# EAGLE design ESP-32-UNICLOCK-VFD (EAGLE 6.3)
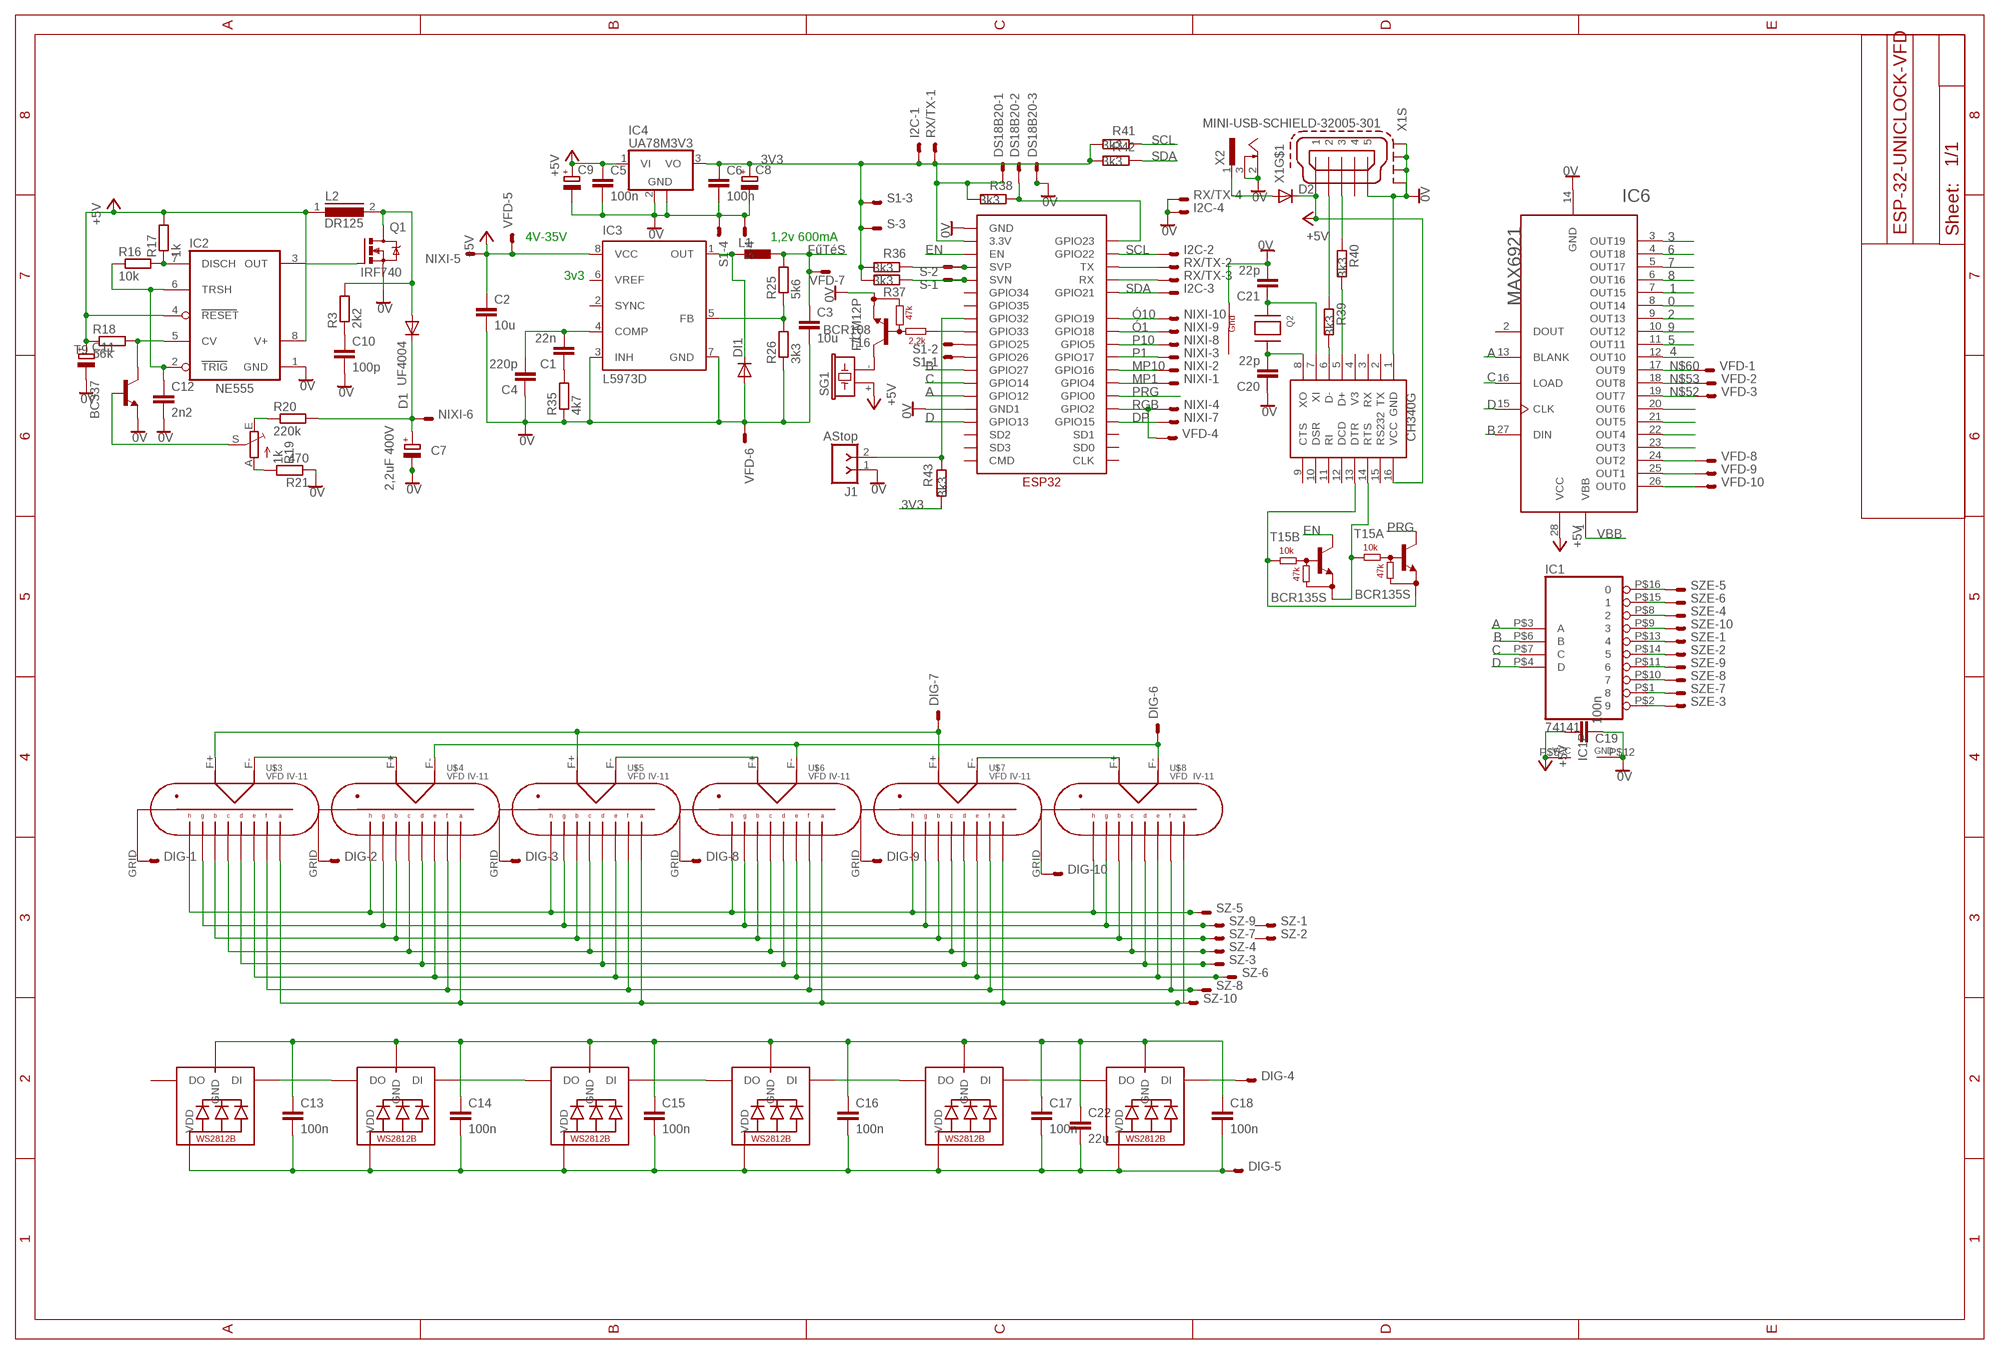
[diagram p0: schematic, sheet 1]

## Parts
C1  22n  C0603  [0603]
C2  10u  C1206  [1206]
C3  10u  C1206  [1206]
C4  220p  C0603  [0603]
C5  100n  C0603  [0603]
C6  100n  C0603  [0603]
C7  2,2uF 400V  CPOL-EUE2.5-7  [E2,5-7]
C8  CPOL-EUE2.5-5  [E2,5-5]
C9  CPOL-EUE2.5-5  [E2,5-5]
C10  100p  C-EU050-024X044  [C050-024X044]
C11  CPOL-EUE2.5-7  [E2,5-7]
C12  2n2  C-EUC0603  [C0603]
C13  100n  C-EUC0603  [C0603]
C14  100n  C-EUC0603  [C0603]
C15  100n  C-EUC0603  [C0603]
C16  100n  C-EUC0603  [C0603]
C17  100n  C-EUC0603  [C0603]
C18  100n  C-EUC0603  [C0603]
C19  100n  C0603  [0603]
C20  22p  C0603  [0603]
C21  22p  C0603  [0603]
C22  22u  C-EUC1206K  [C1206K]
D1  UF4004  BA221  [DO35-10]
D2  DIODE-SOD123  [SOD123]
DI1  DDI214  [DI-214]
DIG  DIG  PAD10  [PAD10]
DS18B20  PAD3  [PAD3]
I2C  PAD4  [PAD4]
IC1  74141  [DIL16SMD]
IC2  NE555  ICM7555  [DIL08]
IC3  L5973D  [HSOP8]
IC4  UA78M3V3  UA78M05DCY  [SOT223]
IC6  MAX6921  MAX6921SOIC28W  [SO-28W]
J1  AStop  F-1X02-SIP-100-32  [SIP-100-02-32]
L1  LDR73A  [DR73A]
L2  DR125  [DR125]
LED1  WS2812B_5050N  [WS2812B-NARROW]
LED2  WS2812B_5050N  [WS2812B-NARROW]
LED3  WS2812B_5050N  [WS2812B-NARROW]
LED4  WS2812B_5050N  [WS2812B-NARROW]
LED5  WS2812B_5050N  [WS2812B-NARROW]
LED6  WS2812B_5050N  [WS2812B-NARROW]
NIXI  PAD10  [PAD10]
Q1  IRF740  [TO220BV]
Q2  XTAL-4-3225  [NX3225]
R3  2k2  R-EU_0204/7  [0204/7]
R16  10k  R-EU_R0603  [R0603]
R17  1k  R-EU_R0603  [R0603]
R18  56k  R-EU_R0603  [R0603]
R19  1k  TRIM_EU-CA6H  [CA6H]
R20  220k  R-EU_0204/7  [0204/7]
R21  470  R-EU_0204/7  [0204/7]
R25  5k6  R0603  [0603]
R26  3k3  R0603  [0603]
R35  4k7  R0603  [0603]
R36  3k3  R0603  [0603]
R37  3k3  R0603  [0603]
R38  3k3  R0603  [0603]
R39  3k3  R0603  [0603]
R40  3k3  R0603  [0603]
R41  3k3  R0603  [0603]
R42  3k3  R0603  [0603]
R43  3k3  R0603  [0603]
RX/TX  PAD4  [PAD4]
S  PAD4  [PAD4]
S1  PAD4  [PAD4]
SG1  F/CM12P  [F/CM12P]
SZ  PAD10  [PAD10]
SZE  PAD10  [PAD10]
T9  BC337  BC237-NPN-TO92-CBE  [TO92-CBE]
T15  BCR135S  [SOT363_INFINEON]
T16  BCR108  [SOT23-BEC]
U$1  CH340G  [SOIC16]
U$2  ESP32-2X18  [ESP322X18]
U$3  VFD IV-11  VFD-IV-11-ZOLI  [VFD-IV_11-ZOLI]
U$4  VFD IV-11  VFD-IV-11-ZOLI  [VFD-IV_11-ZOLI]
U$5  VFD IV-11  VFD-IV-11-ZOLI  [VFD-IV_11-ZOLI]
U$6  VFD IV-11  VFD-IV-11-ZOLI  [VFD-IV_11-ZOLI]
U$7  VFD IV-11  VFD-IV-11-ZOLI  [VFD-IV_11-ZOLI]
U$8  VFD IV-11  VFD-IV-11-ZOLI  [VFD-IV_11-ZOLI]
VFD  PAD10  [PAD10]
X1  MINI-USB-SCHIELD-32005-301  [32005-301]
X2  733989-5  [733989-5]

## Nets
0: IC1.P$16 IC6.8(OUT14) SZE.P$5
0V: C2.2 C3.2 C4.1 C5.2 C6.2 C7.- C8.- C9.- C10.2 C11.- C12.2 C19.2 C20.1 C21.2 DI1.A DS18B20.P$3 I2C.P$4 IC1.P$12(GND) IC2.1(GND) IC3.3(INH) IC3.7(GND) IC4.2(GND) IC4.4(GND) IC6.14(GND) J1.1 Q1.S Q2.4(G1) R21.1 R26.1 R35.1 RX/TX.P$4 S1.P$4 S.P$4 T9.E T16.E U$1.1(GND) U$2.P$19(GND) U$2.P$26(GND1) VFD.P$6 X1.5 X1.M1(S:S1) X1.M2(S:S2) X1.M3(S:S3) X1.M4(S:S4) X2.2 X2.3
1: IC1.P$15 IC6.7(OUT15) SZE.P$6
2: IC1.P$8 IC6.9(OUT13) SZE.P$4
3: IC1.P$9 IC6.3(OUT19) SZE.P$10
3V3: C6.1 C8.+ DS18B20.P$1 I2C.P$1 IC4.3(VO) R36.2 R37.2 R38.2 R41.2 R42.2 R43.2 RX/TX.P$1 S1.P$3 S.P$3 U$2.P$20(3.3V)
4: IC1.P$13 IC6.12(OUT10) SZE.P$1
5: IC1.P$14 IC6.11(OUT11) SZE.P$2
6: IC1.P$11 IC6.4(OUT18) SZE.P$9
7: IC1.P$10 IC6.5(OUT17) SZE.P$8
8: IC1.P$1 IC6.6(OUT16) SZE.P$7
9: IC1.P$2 IC6.10(OUT12) SZE.P$3
+5V: C2.1 C5.1 C9.+ C11.+ C19.1 D2.C IC1.P$5(VCC) IC2.4(RESET) IC2.8(V+) IC3.8(VCC) IC4.1(VI) IC6.28(VCC) L2.1 NIXI.P$5 R17.2 R18.1 SG1.+ U$1.16(VCC) VFD.P$5 X1.1
A: IC1.P$3(A) IC6.13(BLANK) U$2.P$12(GPIO12)
B: IC1.P$6(B) IC6.27(DIN) U$2.P$10(GPIO27)
C: IC1.P$7(C) IC6.16(LOAD) U$2.P$9(GPIO14)
D: IC1.P$4(D) IC6.15(CLK) U$2.P$11(GPIO13)
DP: NIXI.P$7 U$2.P$35(GPIO15)
EN: T15.3(B:C) U$2.P$21(EN)
FűTéS: C3.1 L1.2 R25.2 VFD.P$7
GND: C13.1 C14.1 C15.1 C16.1 C17.1 C18.1 C22.1 DIG.P$6 LED1.3-GND(GND) LED2.3-GND(GND) LED3.3-GND(GND) LED4.3-GND(GND) LED5.3-GND(GND) LED6.3-GND(GND) U$4.F- U$6.F- U$8.F-
MP1: NIXI.P$1 U$2.P$34(GPIO4)
MP10: NIXI.P$2 U$2.P$31(GPIO16)
N$1: T15.1(A:E) T15.5(B:B) U$1.13(DTR)
N$2: S1.P$1 U$2.P$7(GPIO26)
N$3: IC6.26(OUT0) VFD.P$10
N$4: IC6.25(OUT1) VFD.P$9
N$5: C1.1 R35.2
N$6: C1.2 C4.2 IC3.4(COMP)
N$7: IC3.5(FB) R25.1 R26.2
N$8: IC6.24(OUT2) VFD.P$8
N$9: DI1.K(C) IC3.1(OUT) L1.1
N$10: DIG.P$1 U$3.GRID
N$11: DIG.P$2 U$4.GRID
N$12: DIG.P$3 U$5.GRID
N$13: DIG.P$10 U$8.GRID
N$14: DIG.P$9 U$7.GRID
N$15: DIG.P$8 U$6.GRID
N$16: U$7.F- U$8.F+
N$17: U$5.F- U$6.F+
N$18: R19.E R20.1
N$19: U$3.F- U$4.F+
N$20: R19.A R21.2
N$21: DIG.P$7 U$3.F+ U$5.F+ U$7.F+
N$22: IC2.3(OUT) Q1.G
N$23: IC2.7(DISCH) R16.2 R17.1
N$24: C12.1 IC2.2(TRIG) IC2.6(TRSH) R16.1
N$26: IC2.5(CV) R18.2 T9.C
N$27: C10.1 R3.1
N$28: R37.1 S.P$1 U$2.P$1(SVN)
N$43: IC6.23(OUT3)
N$44: D1.A L2.2 Q1.D R3.2
N$46: DS18B20.P$2 R38.1 U$2.P$23(GPIO23)
N$49: IC6.22(OUT4)
N$50: IC6.21(OUT5)
N$51: IC6.20(OUT6)
N$52: IC6.19(OUT7) VFD.P$3
N$53: IC6.18(OUT8) VFD.P$2
N$54: LED1.2-DOUT(DO) LED2.4-DIN(DI)
N$55: LED2.2-DOUT(DO) LED3.4-DIN(DI)
N$57: SZ.P$5 U$3.H U$4.H U$5.H U$6.H U$7.H U$8.H
N$58: SZ.P$9 U$3.G U$4.G U$5.G U$6.G U$7.G U$8.G
N$59: SZ.P$7 U$3.B U$4.B U$5.B U$6.B U$7.B U$8.B
N$60: IC6.17(OUT9) VFD.P$1
N$61: SZ.P$4 U$3.C U$4.C U$5.C U$6.C U$7.C U$8.C
N$62: SZ.P$3 U$3.D U$4.D U$5.D U$6.D U$7.D U$8.D
N$63: SZ.P$6 U$3.E U$4.E U$5.E U$6.E U$7.E U$8.E
N$64: SZ.P$8 U$3.F U$4.F U$5.F U$6.F U$7.F U$8.F
N$65: LED3.2-DOUT(DO) LED4.4-DIN(DI)
N$66: LED4.2-DOUT(DO) LED5.4-DIN(DI)
N$70: D2.A X2.1
N$71: DIG.P$4 LED1.4-DIN(DI)
N$72: R36.1 S.P$2 U$2.P$2(SVP)
N$73: S1.P$2 U$2.P$8(GPIO25)
N$74: R39.1 X1.2
N$75: R40.2 U$1.5(D+)
N$76: R39.2 U$1.6(D-)
N$77: R40.1 X1.3
N$78: LED5.2-DOUT(DO) LED6.4-DIN(DI)
N$79: T15.2(A:B) T15.4(B:E) U$1.14(RTS)
N$80: C20.2 Q2.3(X2) U$1.8(XO)
N$81: C13.2 C14.2 C15.2 C16.2 C17.2 C18.2 C22.2 DIG.P$5 LED1.1-VDD(VDD) LED2.1-VDD(VDD) LED3.1-VDD(VDD) LED4.1-VDD(VDD) LED5.1-VDD(VDD) LED6.1-VDD(VDD)
N$89: C21.1 Q2.1(X1) U$1.7(XI)
N$92: RX/TX.P$2 U$2.P$22(TX)
N$93: RX/TX.P$3 U$2.P$24(RX)
N$94: SG1.- T16.C
N$95: T16.B U$2.P$5(GPIO33)
N$96: J1.2 R43.1 U$2.P$6(GPIO32)
N$105: SZ.P$10 U$3.A U$4.A U$5.A U$6.A U$7.A U$8.A
N$119: R19.S T9.B
P1: NIXI.P$3 U$2.P$32(GPIO17)
P10: NIXI.P$8 U$2.P$29(GPIO5)
PRG: T15.6(A:C) U$2.P$33(GPIO0)
RGB: NIXI.P$4 U$2.P$36(GPIO2) VFD.P$4
SCL: I2C.P$2 R41.1 U$2.P$25(GPIO22)
SDA: I2C.P$3 R42.1 U$2.P$28(GPIO21)
VBB: C7.+ D1.C IC6.1(VBB) NIXI.P$6 R20.2
Ó1: NIXI.P$9 U$2.P$30(GPIO18)
Ó10: NIXI.P$10 U$2.P$27(GPIO19)
Unconnected: IC3.2(SYNC) IC3.6(VREF) IC3.EXP IC6.2(DOUT) LED6.2-DOUT(DO) SZ.P$1 SZ.P$2 U$1.2(TX) U$1.3(RX) U$1.4(V3) U$1.9(CTS) U$1.10(DSR) U$1.11(RI) U$1.12(DCD) U$1.15(RS232) U$2.P$3(GPIO35) U$2.P$4(GPIO34) U$2.P$13(SD3) U$2.P$14(SD2) U$2.P$15(CLK) U$2.P$16(CMD) U$2.P$17(SD1) U$2.P$18(SD0) X1.4

## Notes on the sheet
- 4V-35V | 1,2v 600mA
- 3v3

## Power pins joined to a net without a drawn wire
G2: Q2.2(G2)

## Library data of the parts
C1-C6 C19-C21 =  Zozo:C
C7-C9 C11 = resistor:CPOL-EU: POLARIZED CAPACITOR, European symbol
C10 C12-C18 C22 = resistor:C-EU: CAPACITOR, European symbol
D1 = diode:BA221: DIODE high speed (Philips)
D2 = diode:DIODE-: DIODE
DI1 =  Zozo:D
DIG NIXI SZ SZE VFD = tuskesor:PAD10
DS18B20 = tuskesor:PAD3
I2C RX/TX S S1 = tuskesor:PAD4
IC1 = 74xx-eu:74*141: BCD to decimal DECODER/DRIVER
IC2 = maxim1:ICM7555: TIMER; MF: MAXIM; MPN: ICM7555IPA+; OC_FARNELL: 9663762; OC_NEWARK: 68K4387
IC3 = st-microelectronics:L5973D: 2.5 A switch step down switching regulator Source: Data sheet <http://www.st.com/internet/com/TECHNICAL_RESOURCES/TECHNICAL_LITERATURE/DATASHEET/CD00002851.pdf>; MF: STMICROELECTRONICS; MPN: L5973D; OC_FARNELL: 1077145
IC4 = linear:UA78M*: POSITIVE-VOLTAGE REGULATORS Source: http://focus.ti.com/lit/ds/symlink/ua78m33.pdf
IC6 = JVN:MAX6921
J1 = con-headers-jp:F-1X02-: FEMALE HEADER
L1 =  Zozo:L
L2 = inductors:DR125: High Power Density, High Efficiency, Shielded Inductors Source: coiltronics_dr_series.pdf
LED1-LED6 = adafruit:WS2812B
Q1 = transistor-power:IRF740: N-CHANNEL MOS FET
Q2 = adafruit:XTAL-4: Classic 4-pin 3.2 x 2.5mm crystal
R3 R16-R18 R20 R21 = resistor:R-EU_: RESISTOR, European symbol
R19 = pot:TRIM_EU-: POTENTIOMETER
R25 R26 R35-R43 =  Zozo:R
SG1 = buzzer:F/CM12P: BUZZER Source: Buerklin; OC_FARNELL: unknown; OC_NEWARK: unknown
T9 = transistor:*-NPN-: NPN Transistror BF959 corrected 2008.03.06
T15 = digital-transistors-1:BCR135S: Dual NPN Silicon Digital Transistor 50V 0,1A 0,25W
T16 = digital-transistors:BCR108: NPN Silicon Digital Transistor 50V 0,1A 0,2W
U$1 = ch340g:CH340G
U$2 = ESP32:ESP32-2X18
U$3-U$8 =   IV-11 cső:VFD-IV-11-ZOLI
X1 = con-cypressindustries:MINI-USB-SCHIELD-: MINI USB-B Conector Source: www.cypressindustries.com; OC_FARNELL: unknown; OC_NEWARK: unknown
X2 = con-conrad:73398?: FEMALE PRINT CONNECTOR Niedervolt-Steckverbinder Distributor Conrad

## Board
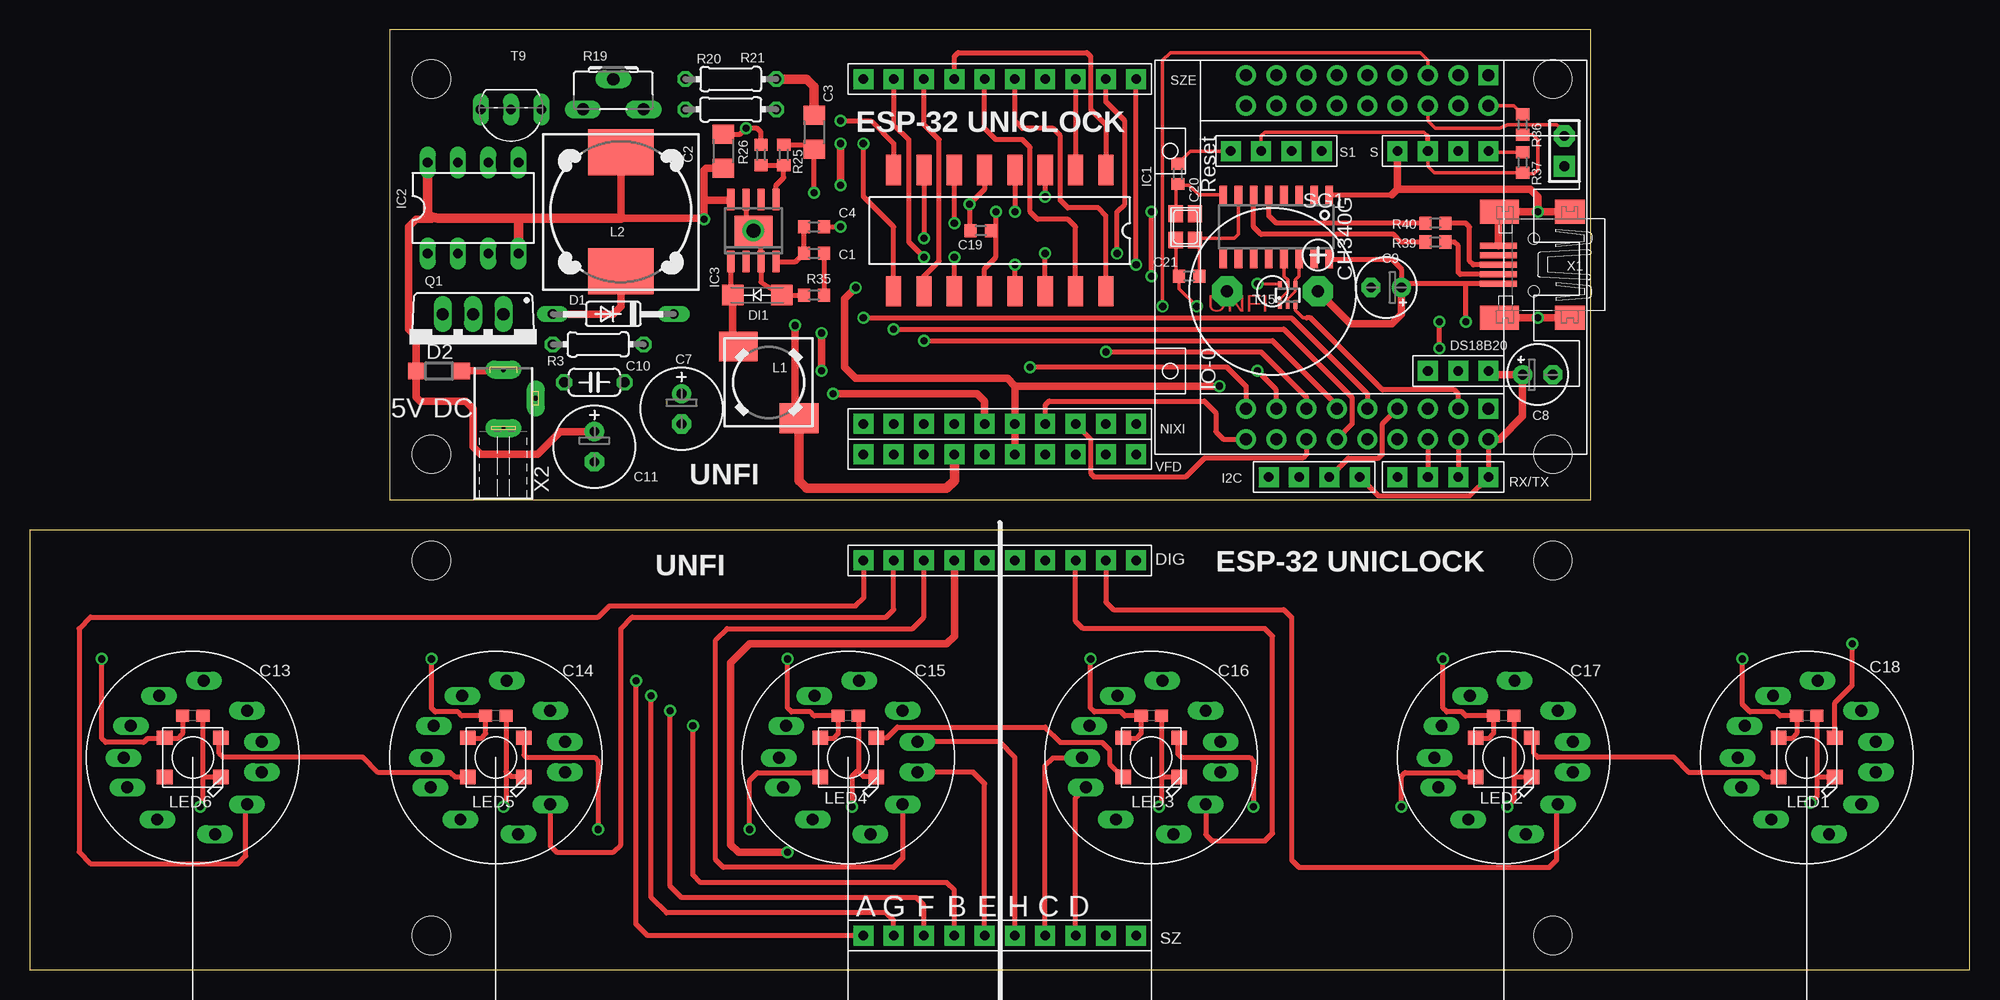
[diagram p1: board, top side]
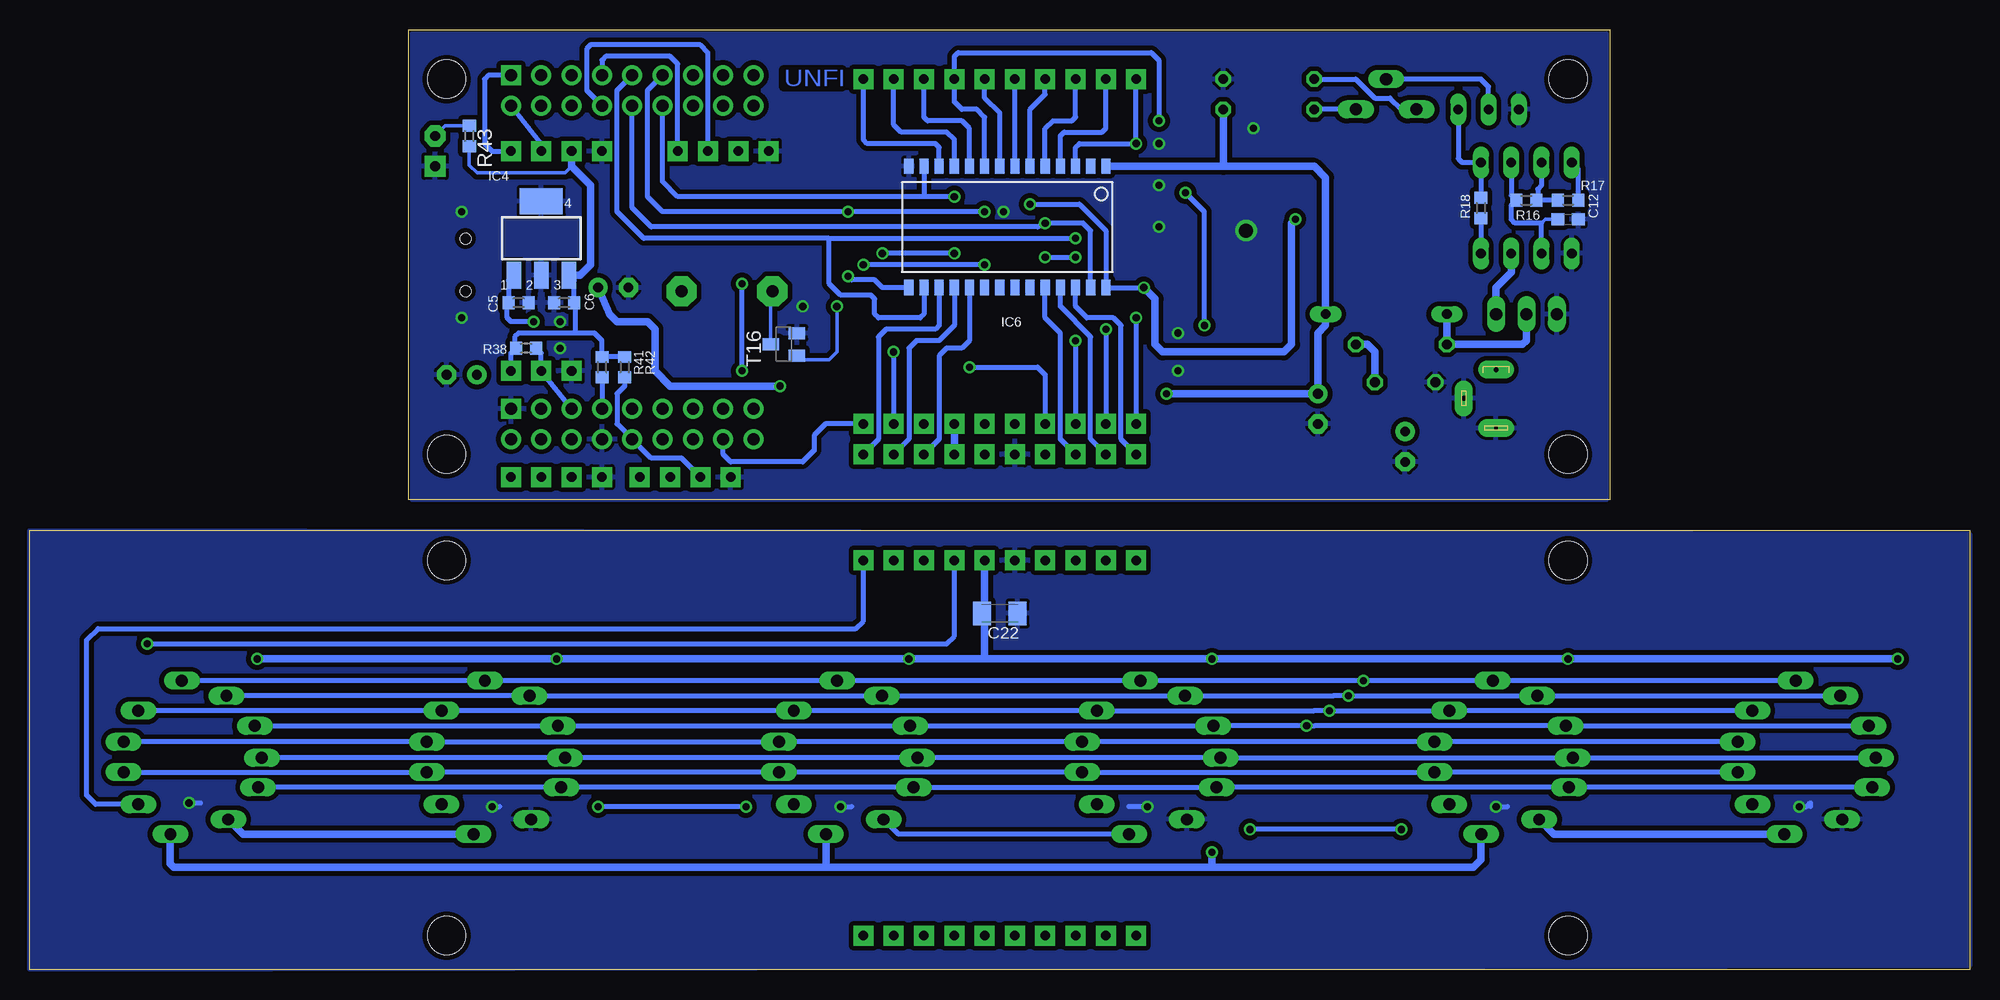
[diagram p2: board, bottom side, seen from below]

Size 162.56 x 78.74 mm. Coordinates in mm from the lower left corner, seen from the top.
Outline: 0,0 162.56,0 162.56,36.83 0,36.83 0,0
Outline: 30.16,39.37 130.81,39.37 130.81,78.74 30.16,78.74 30.16,39.37
Copper layers (1*16): Top 0.035mm / dielectric 1.5mm / Bottom 0.035mm
Design rules "default *": minimum track width 10mil, minimum drill 24mil, track to track 8mil, track to pad 8mil, pad to pad 8mil, via to via 8mil, smd to smd 8mil, copper to edge 0mil, drill to drill 8mil, minimum pad ring 10mil, minimum via ring 8mil, stop-mask expansion 4mil, vias tented up to drill 0mil, thermal gap 10mil
Holes 3.2 mm at 33.66,74.61 33.66,43.18 127.64,43.18 127.64,74.61 127.64,34.29 33.66,34.29 33.66,2.86 127.64,2.86

### Footprints (pad centres in the part's own frame; a part is rotated, then mirrored left to right if it is on the bottom)
0603 = smd 1 x 1.1: 1 -0.85,0; 2 0.85,0
1206 = smd 1.6 x 1.803: 1 -1.422,0; 2 1.422,0
E2,5-7 = drill 0.813 pad 1.6: + -1.27,0 | drill 0.813 pad 1.6 octagon: - 1.27,0
E2,5-5 = drill 0.813 pad 1.6: + -1.27,0 | drill 0.813 pad 1.6 octagon: - 1.27,0
C050-024X044 = drill 0.813 octagon: 1 -2.54,0; 2 2.54,0
C0603 = smd 1.1 x 1: 1 -0.85,0; 2 0.85,0
C1206K = smd 1.5 x 2: 1 -1.5,0; 2 1.5,0
DO35-10 = drill 0.813 long: A 5.08,0; C -5.08,0
SOD123 = smd 1.4 x 1.4: A 1.9,0; C -1.9,0
DI-214 = smd 1.8 x 1.7: A -2.05,0; K 2.05,0
PAD10 = drill 0.8 pad 1.676 square: P$1 0,0; P$2 2.54,0; P$3 5.08,0; P$4 7.62,0; P$5 10.16,0; P$6 12.7,0; P$7 15.24,0; P$8 17.78,0; P$9 20.32,0; P$10 22.86,0
PAD3 = drill 0.8 pad 1.676 square: P$1 0,0; P$2 2.54,0; P$3 5.08,0
PAD4 = drill 0.8 pad 1.676 square: P$1 0,0; P$2 2.54,0; P$3 5.08,0; P$4 7.62,0
DIL16SMD = smd 1.27 x 2.54: P$1 0,0; P$2 2.54,0; P$3 5.08,0; P$4 7.62,0; P$5 10.16,0; P$6 12.7,0; P$7 15.24,0; P$8 17.78,0; P$9 17.78,10.16; P$10 15.24,10.16; P$11 12.7,10.16; P$12 10.16,10.16; P$13 7.62,10.16; P$14 5.08,10.16; P$15 2.54,10.16; P$16 0,10.16
DIL08 = drill 0.813 long: 1 -3.81,-3.81; 2 -1.27,-3.81; 3 1.27,-3.81; 4 3.81,-3.81; 5 3.81,3.81; 6 1.27,3.81; 7 -1.27,3.81; 8 -3.81,3.81
HSOP8 = smd 0.6 x 1.8: 1 -1.905,-2.6; 2 -0.635,-2.6; 3 0.635,-2.6; 4 1.905,-2.6; 5 1.905,2.6; 6 0.635,2.6; 7 -0.635,2.6; 8 -1.905,2.6 | smd 3.2 x 2.51: EXP 0,0
SOT223 = smd 1.219 x 2.235: 1 -2.311,-3.099; 2 0,-3.099; 3 2.311,-3.099 | smd 3.6 x 2.2: 4 0,3.099
SO-28W = smd 0.762 x 1.27: 1 -8.255,-5.08; 2 -6.985,-5.08; 3 -5.715,-5.08; 4 -4.445,-5.08; 5 -3.175,-5.08; 6 -1.905,-5.08; 7 -0.635,-5.08; 8 0.635,-5.08; 9 1.905,-5.08; 10 3.175,-5.08; 11 4.445,-5.08; 12 5.715,-5.08; 13 6.985,-5.08; 14 8.255,-5.08; 15 8.255,5.08; 16 6.985,5.08; 17 5.715,5.08; 18 4.445,5.08; 19 3.175,5.08; 20 1.905,5.08; 21 0.635,5.08; 22 -0.635,5.08; 23 -1.905,5.08; 24 -3.175,5.08; 25 -4.445,5.08; 26 -5.715,5.08; 27 -6.985,5.08; 28 -8.255,5.08
SIP-100-02-32 = drill 0.813 pad 1.778 square: 1 -1.27,0 | drill 0.813 pad 1.778 octagon: 2 1.27,0
DR73A = smd 2.5 x 3.25: 1 -3,-2.54; 2 3,2.54
DR125 = smd 3.85 x 5.5: 1 -4.975,0; 2 4.975,0
WS2812B-NARROW = smd 1.3 x 1.2: 1-VDD 2.35,-1.65; 2-DOUT 2.35,1.65; 3-GND -2.35,1.65; 4-DIN -2.35,-1.65
TO220BV = drill 1.016 long: D 0,-2.54; G -2.54,-2.54; S 2.54,-2.54
NX3225 = smd 1.4 x 1.2: 1 -1.1,-0.8; 2 1.1,-0.8; 3 1.1,0.8; 4 -1.1,0.8
0204/7 = drill 0.813 octagon: 1 -3.81,0; 2 3.81,0
R0603 = smd 1 x 1.1: 1 -0.85,0; 2 0.85,0
CA6H = drill 1.016 long: A -2.54,0; E 2.54,0; S 0,2.54
F/CM12P = drill 1.016 pad 2.54 octagon: + 3.81,0; - -3.81,0
TO92-CBE = drill 0.813 long: B 0,0; C -2.54,0; E 2.54,0
SOT363_INFINEON = smd 0.3 x 0.7: 1 -0.65,-0.8; 2 0,-0.8; 3 0.65,-0.8; 4 0.65,0.8; 5 0,0.8; 6 -0.65,0.8
SOT23-BEC = smd 1 x 1.4: B -0.95,-1.1; C 0,1.1; E 0.95,-1.1
SOIC16 = smd 0.635 x 1.524: 1 -4.445,-2.695; 2 -3.175,-2.695; 3 -1.905,-2.695; 4 -0.635,-2.695; 5 0.635,-2.695; 6 1.905,-2.695; 7 3.175,-2.695; 8 4.445,-2.695; 9 4.445,2.695; 10 3.175,2.695; 11 1.905,2.695; 12 0.635,2.695; 13 -0.635,2.695; 14 -1.905,2.695; 15 -3.175,2.695; 16 -4.445,2.695
ESP322X18 = drill 1 pad 1.676 square: P$1 0,0; P$19 27.94,0 | drill 1 pad 1.676: P$2 2.54,0; P$3 0,-2.54; P$4 2.54,-2.54; P$5 0,-5.08; P$6 2.54,-5.08; P$7 0,-7.62; P$8 2.54,-7.62; P$9 0,-10.16; P$10 2.54,-10.16; P$11 0,-12.7; P$12 2.54,-12.7; P$13 0,-15.24; P$14 2.54,-15.24; P$15 0,-17.78; P$16 2.54,-17.78; P$17 0,-20.32; P$18 2.54,-20.32; P$20 30.48,0; P$21 27.94,-2.54; P$22 30.48,-2.54; P$23 27.94,-5.08; P$24 30.48,-5.08; P$25 27.94,-7.62; P$26 30.48,-7.62; P$27 27.94,-10.16; P$28 30.48,-10.16; P$29 27.94,-12.7; P$30 30.48,-12.7; P$31 27.94,-15.24; P$32 30.48,-15.24; P$33 27.94,-17.78; P$34 30.48,-17.78; P$35 27.94,-20.32; P$36 30.48,-20.32
VFD-IV_11-ZOLI = drill 1 pad 1.422 long: A 0.918,6.43; B -5.195,2.655; C -5.795,-0.035; D -5.478,-2.506; E 5.795,-1.236; F 4.56,3.925; F+ 1.871,-6.43; F- -2.973,-5.195; G -2.823,5.16; GRID 4.56,-3.925; H 5.795,1.302
32005-301 = smd 3.1 x 0.5: 1 3,1.6; 2 3,0.8; 3 3,0; 4 3,-0.8; 5 3,-1.6 | smd 2.5 x 2: M1 -3,-4.45; M2 -3,4.45 | smd 3.3 x 2: M3 2.9,4.45; M4 2.9,-4.45 | hole 0.9: 0,2.2; 0,-2.2
733989-5 = drill 0.4 pad 1.5 long: 1 0,5.82; 3 2.7,3.42 | drill 0.3 pad 1.5 long: 2 0,0.92

### Placement (x,y rotation side)
C1  65.72,60.01 180 top
C2  58.1,68.58 90 top
C3  65.72,70.17 90 top
C4  65.72,62.23 180 top
C5  121.6,55.88 0 bottom
C6  117.79,55.88 180 bottom
C7  54.61,46.99 270 top
C8  126.37,49.85 0 top
C9  113.67,57.15 180 top
C10  47.31,49.21 180 top
C11  47.31,43.81 270 top
C12  33.66,62.86 0 bottom
C13  13.65,21.27 180 top
C14  39.05,21.27 180 top
C15  68.58,21.27 180 top
C16  93.98,21.27 180 top
C17  123.51,21.27 180 top
C18  148.91,21.27 180 top
C19  79.69,61.91 0 top
C20  96.2,66.67 270 top
C21  97.16,58.1 180 top
C22  81.28,29.84 180 bottom
D1  48.89,54.93 180 top
D2  34.29,50.16 0 top
DI1  60.96,56.52 180 top
DIG  92.71,34.29 180 top
DS18B20  122.24,50.16 180 top
I2C  111.44,41.27 180 top
IC1  90.17,66.99 180 top
IC2  37.15,63.82 0 top
IC3  60.64,61.91 0 top
IC4  119.7,61.28 0 bottom
IC6  80.64,62.23 180 bottom
J1  128.59,68.58 90 top
L1  61.91,49.21 270 top
L2  49.53,63.5 270 top
LED1  148.91,17.78 180 top
LED2  123.51,17.78 180 top
LED3  93.98,17.78 180 top
LED4  68.58,17.78 180 top
LED5  39.05,17.78 180 top
LED6  13.65,17.78 180 top
NIXI  92.71,45.72 180 top
Q1  37.15,52.39 180 top
Q2  96.84,62.23 90 top
R3  47.62,52.39 180 top
R16  37.15,64.45 0 bottom
R17  33.66,64.45 0 bottom
R18  40.96,63.82 90 bottom
R19  48.89,72.07 0 top
R20  58.74,72.07 0 top
R21  58.74,74.61 180 top
R25  63.18,68.26 90 top
R26  61.28,68.26 270 top
R35  65.72,56.52 0 top
R36  125.09,70.8 270 top
R37  125.09,67.63 270 top
R38  120.97,52.07 180 bottom
R39  117.79,60.96 180 top
R40  117.79,62.55 180 top
R41  114.62,50.48 90 bottom
R42  112.71,50.48 90 bottom
R43  125.73,69.85 270 bottom
RX/TX  122.24,41.27 180 top
S  122.24,68.58 180 top
S1  108.27,68.58 180 top
SG1  104.14,56.83 0 top
SZ  92.71,2.86 180 top
SZE  92.71,74.61 180 top
T9  40.32,72.07 180 top
T15  105.41,56.52 0 top
T16  99.38,52.39 90 bottom
U$1  104.46,62.23 180 top
U$2  122.24,74.93 270 top
U$3  148.91,17.78 0 top
U$4  123.51,17.78 0 top
U$5  93.98,17.78 0 top
U$6  68.58,17.78 0 top
U$7  39.05,17.78 0 top
U$8  13.65,17.78 0 top
VFD  92.71,43.18 180 top
X1  126.05,59.05 180 top
X2  39.69,44.45 0 top

### Tracks (layer width: path | path; a pad name or v marks a point on that pad's centre or on a via)
0
  Top 0.406: IC1.P$16 90.17,63.18 89.53,63.82 87,63.82 86.36,64.45 86.36,69.85 85.72,70.49 83.19,70.49 82.55,71.12 SZE.P$5
  Bottom 0.406: IC6.8 81.28,71.75 82.55,73.03 SZE.P$5
0V  (via drill 0.6, 1.2)
  Top 0.305: S1.P$4 97.26,68.58 C20.1 | Q2.4 96.04,58.37 C21.2 96.31,57.05 v97.79,55.56
  Top 0.406: IC3.7 60.01,62.55 v60.64,61.91 61.28,61.28 IC3.3 61.28,57.61 DI1.A R35.1 | C4.1 v67.95,62.23 | C2.2 59.52,70 v60.01,70.49 60.96,70.49 61.28,70.17 R26.1 | IC1.P$12 80.01,58.74 80.96,59.69 80.96,61.91 | 80.96,61.91 v80.96,63.5 | C19.2 80.96,61.91 | U$1.1 114.14,64.92 | v118.11,52.07 v118.11,54.29
  Top 0.61: v67.95,65.72 v67.95,69.21 | v66.36,53.34 v66.36,50.17 | X1.M2 v126.37,54.6 v126.37,54.61 v126.36,54.6 X1.M3 | X1.M1 v126.37,63.5 | v126.37,63.5 v126.36,63.5 X1.M4 123.05,63.41 X1.5 | S.P$4 114.62,65.41 | 114.62,65.41 114.14,64.92 | 114.62,65.41 125.73,65.41 126.37,64.77 v126.37,63.5
  Top 0.813: R21.1 65.09,74.61 65.72,73.98 C3.2
  pour Bottom (isolate 0.406): 30.48,39.37 130.49,39.37 130.49,78.42 30.48,78.42
1
  Top 0.406: IC1.P$15 87.63,62.23 87,62.86 84.45,62.86 83.82,63.5 83.82,68.9 83.19,69.53 80.96,69.53 80.01,70.49 SZE.P$6
  Bottom 0.406: IC6.7 SZE.P$6
2  (via drill 0.6)
  Top 0.406: v67.95,71.12 70.48,71.12 72.39,69.21 IC1.P$8
  Bottom 0.406: IC6.9 82.55,71.44 83.19,72.07 84.45,72.07 85.09,72.71 SZE.P$4 85.09,76.52 84.77,76.84 68.58,76.84 67.95,76.2 v67.95,71.12
3  (via drill 0.6)
  Top 0.406: IC1.P$9 72.39,62.23 69.85,64.77 v69.85,69.21
  Bottom 0.406: IC6.3 74.93,68.9 74.61,69.21 v69.85,69.21 SZE.P$10
3V3
  Top 0.305: S1.P$3 103.19,69.85 103.51,70.17 116.84,70.17 117.16,69.85 | S.P$3 117.16,67.31 117.69,66.78 R37.2 125.2,66.67 126.05,66.67 126.37,66.99 126.37,69.53 125.95,69.95 R36.2
  Top 0.406: S.P$3 117.16,69.85 | U$2.P$20 RX/TX.P$1 120.65,39.69 113.03,39.69 I2C.P$1
  Top 0.61: U$2.P$20 123.19,44.45 125.09,46.35 C8.+ 122.87,49.85 DS18B20.P$1
  Bottom 0.305: R43.2 125.73,67.41 R37.2 117.69,66.78 117.32,67.15 117.32,68.42 S.P$3
  Bottom 0.406: IC4.3 116.94,57.74 C6.1 116.84,55.78 116.84,53.34 | DS18B20.P$1 122.24,51.65 R38.2 121.92,52.17 121.92,53.02 121.6,53.34 116.84,53.34 | R42.2 R41.2 114.62,52.71 115.25,53.34 116.84,53.34
  Bottom 0.61: IC4.3 116.45,58.18 115.57,59.06 115.57,65.72 117.16,67.31 S.P$3
4  (via drill 0.6)
  Top 0.406: IC1.P$13 v82.55,59.06 | v92.71,59.06 SZE.P$1
  Bottom 0.406: v82.55,59.06 v92.71,59.06 | IC6.12 86.36,68.9 86.68,69.21 92.39,69.21 92.71,69.53 SZE.P$1
5  (via drill 0.6)
  Top 0.406: IC1.P$14 v85.09,60.01 | v91.12,60.01 91.12,63.5 91.76,64.13 91.76,71.12 90.17,72.71 SZE.P$2
  Bottom 0.406: IC6.11 85.09,69.53 85.72,70.17 89.53,70.17 90.17,70.8 SZE.P$2 | v85.09,60.01 v91.12,60.01
6  (via drill 0.6)
  Top 0.406: SZE.P$9 72.39,70.8 73.66,69.53 73.66,60.96 v74.93,59.69 | IC1.P$11 v77.47,59.69
  Bottom 0.406: IC6.4 76.2,69.85 75.88,70.17 72.71,70.17 72.39,70.49 SZE.P$9 | v77.47,59.69 v74.93,59.69
7
  Top 0.406: IC1.P$10 74.93,58.1 76.2,59.37 76.2,69.53 74.93,70.8 SZE.P$8
  Bottom 0.406: IC6.5 77.47,70.49 76.83,71.12 75.25,71.12 74.93,71.44 SZE.P$8
8
  Top 0.406: SZE.P$7 77.47,76.52 77.79,76.84 88.58,76.84 88.9,76.52 88.9,72.07 90.17,70.8 IC1.P$1
  Bottom 0.406: IC6.6 78.74,72.07 77.47,73.34 SZE.P$7
9
  Top 0.406: SZE.P$3 IC1.P$2
  Bottom 0.406: IC6.10 83.82,70.49 84.45,71.12 87.31,71.12 87.63,71.44 SZE.P$3
+5V  (via drill 0.6)
  Top 0.406: IC1.P$5 80.01,65.41 v78.74,64.13 78.74,62.02 C19.1 | U$1.16 114.14,59.53 114.94,58.74 C9.+ 115.24,57.46 120.33,57.46 | X1.1 120.33,57.46 | v120.33,54.29 120.33,57.46
  Top 0.61: v69.22,57.15 68.26,56.2 68.26,50.48 69.22,49.53 81.92,49.53 82.55,48.89 | 56.52,64.45 v56.52,62.86 56.41,62.97 49.53,62.97 L2.1 | 56.52,64.45 58.68,64.45 IC3.8 | C2.1 56.68,67.16 56.52,66.99 56.52,64.45 | 82.55,48.89 v99.7,48.89 | 82.55,48.89 NIXI.P$5 VFD.P$5 | 33.34,63.18 33.66,62.86 32.38,62.86 31.75,62.23 31.75,53.66 32.38,53.02 D2.C | D2.C | D2.C 32.38,47.94 32.7,47.63 36.51,47.63 37.15,46.99 37.15,43.81 37.78,43.18 42.55,43.18 44.45,45.09 C11.+ | SG1.+ 110.65,54.13 114.14,54.13 114.94,54.93 C9.+
  Top 0.813: R18.1 34.19,62.97 33.34,63.18 IC2.8 | IC2.4 R18.1 | R18.1 49.53,62.97
  Bottom 0.406: v69.22,57.15 IC6.28 72.39,61.91 74.61,64.13 v78.74,64.13 | R17.2 32.8,67.1 IC2.8 | R18.1 IC2.4 | IC4.1 122.45,57.74 C5.1 122.56,55.78 122.56,54.61 122.24,54.29 v120.33,54.29
  Bottom 0.61: v69.22,57.15 68.26,56.2 68.26,52.39 67.63,51.75 57.47,51.75 56.83,52.39 56.83,62.55 v56.52,62.86 | v99.7,48.89 108.9,48.89 110.17,50.17 110.17,53.66 110.81,54.29 113.35,54.29 113.98,54.93 C9.+
A  (via drill 0.6)
  Top 0.406: IC1.P$3 v85.09,64.77
  Bottom 0.406: v85.09,64.77 87.63,64.77 | 87.63,64.77 108.27,64.77 109.54,66.04 U$2.P$12 | IC6.13 87.63,64.77
B  (via drill 0.6)
  Top 0.406: v77.47,62.55 IC1.P$6
  Bottom 0.406: IC6.27 73.66,61.91 74.3,62.55 v77.47,62.55 78.11,62.23 110.49,62.23 112.08,63.82 U$2.P$10
C  (via drill 0.6)
  Top 0.406: IC1.P$7 v74.93,61.28
  Bottom 0.406: 95.57,61.28 111.12,61.28 113.35,63.5 113.35,73.66 U$2.P$9 | IC6.16 87.63,54.93 87.95,54.61 91.44,54.61 91.76,54.93 91.76,56.2 92.08,56.52 94.62,56.52 95.57,57.47 95.57,61.28 | 95.57,61.28 v74.93,61.28
D  (via drill 0.6)
  Top 0.406: IC1.P$4 v82.55,63.5 | v93.98,58.1 v93.98,63.5
  Bottom 0.406: v82.55,63.5 v93.98,63.5 109.54,63.5 110.81,64.77 110.81,73.66 U$2.P$11 | IC6.15 91.12,57.15 91.76,57.78 93.66,57.78 v93.98,58.1
DP  (via drill 0.6)
  Top 0.406: v83.82,50.48 100.33,50.48 101.92,48.89 U$2.P$35
  Bottom 0.406: v83.82,50.48 78.11,50.48 77.47,49.85 NIXI.P$7
EN
  Top 0.305: T15.3 106.06,55.23 106.68,54.61 107,54.61
  Top 0.406: U$2.P$21 119.7,48.26 119.38,48.58 113.35,48.58 107.31,54.61 107,54.61
FűTéS  (via drill 0.6)
  Top 0.406: v65.72,65.09 C3.1 65.36,69.11 R25.2
  Top 0.61: v64.14,53.98 64.14,46.53 L1.2
  Top 0.813: VFD.P$7 77.47,40.96 76.83,40.32 65.09,40.32 64.45,40.96 L1.2
  Bottom 0.406: v64.14,53.98 64.14,63.5 v65.72,65.09
GND  (via drill 0.6)
  Top 0.406: 96.27,16.19 LED3.3-GND 96.27,16.13 | 69.43,16.61 69.85,16.19 70.87,16.19 LED4.3-GND | 39.9,16.61 40.32,16.19 41.34,16.19 LED5.3-GND | C15.1 69.43,16.61 | C14.1 39.9,16.61 | C13.1 14.5,16.13 | 14.5,16.13 14.5,13.87 v14.29,13.65 | 39.9,16.61 39.9,13.87 v39.69,13.65 | 69.43,16.61 69.32,16.61 68.9,16.19 v68.9,13.65 | 96.52,16.19 96.2,16.19 96.27,16.13 | C16.1 94.83,16.19 | 94.83,16.19 94.83,13.87 v94.62,13.65 | 96.27,16.13 94.89,16.13 94.83,16.19 | C17.1 124.36,16.19 | 124.36,16.19 124.36,14.18 v123.83,13.65 | LED2.3-GND 124.42,16.13 124.36,16.19 | C18.1 149.76,16.19 | 149.76,16.19 149.76,14.5 v149.22,13.97 | LED1.3-GND 149.82,16.13 149.76,16.19 | LED6.3-GND 14.5,16.13
  Bottom 0.406: v14.29,13.65 13.65,13.65 13.34,13.97 13.34,13.65 | v39.69,13.65 38.73,13.65 | v68.9,13.65 70.48,13.65 | v94.62,13.65 93.66,13.65 | v123.83,13.65 123.19,13.65 | v149.22,13.97 148.27,13.97
  pour Bottom (isolate 0.406): 0,0.32 162.56,0 162.56,36.83 0,36.51
MP1
  Bottom 0.406: NIXI.P$1 95.89,45.72 96.84,44.77 96.84,43.5 97.79,42.54 103.82,42.54 104.46,43.18 U$2.P$34
MP10  (via drill 0.6)
  Top 0.406: v90.17,51.75 103.19,51.75 107,47.94 U$2.P$31
  Bottom 0.406: v90.17,51.75 NIXI.P$2
N$1
  Top 0.254: T15.1 104.76,56.18 105.41,56.83 T15.5
  Top 0.305: T15.5 105.41,57.78 105.09,58.1 U$1.13
N$2
  Bottom 0.406: S1.P$1 108.27,75.88 108.9,76.52 114.3,76.52 114.62,76.2 U$2.P$7
N$3
  Bottom 0.406: VFD.P$10 71.12,44.45 71.12,53.98 71.75,54.61 73.98,54.61 74.93,55.56 IC6.26
N$4
  Bottom 0.406: VFD.P$9 73.66,44.45 73.66,53.02 76.2,55.56 IC6.25
N$5
  Top 0.406: C1.1 R35.2
N$6
  Top 0.406: IC3.4 64.18,59.31 C1.2 C4.2
N$7
  Top 0.406: R26.2 R25.1 63.18,66.36 62.55,65.72 IC3.5
N$8
  Bottom 0.406: VFD.P$8 76.2,44.45 76.2,53.34 77.47,54.61 IC6.24
N$9
  Top 0.406: IC3.1 58.74,56.98 DI1.K
  Top 0.61: DI1.K 58.91,52.67 L1.1
N$10
  Bottom 0.406: U$3.GRID 157.05,13.85 157.8,14.6 157.8,27.62 156.84,28.57 93.34,28.57 92.71,29.21 DIG.P$1
N$11
  Top 0.406: DIG.P$2 90.17,30.8 90.81,30.16 105.09,30.16 105.73,29.53 105.73,9.21 106.36,8.57 127.32,8.57 127.95,9.21 127.95,13.74 U$4.GRID
N$12
  Top 0.406: U$5.GRID 98.54,11.31 99.06,10.79 103.51,10.79 104.14,11.43 104.14,27.94 103.51,28.57 88.27,28.57 87.63,29.21 DIG.P$3
N$13
  Top 0.406: DIG.P$10 69.85,31.12 69.22,30.48 48.58,30.48 47.62,29.53 5.08,29.53 4.13,28.57 4.13,9.84 5.08,8.89 17.46,8.89 18.1,9.52 18.1,13.74 U$8.GRID
N$14
  Top 0.406: U$7.GRID 43.61,10.36 44.13,9.84 48.89,9.84 49.53,10.48 49.53,28.57 50.48,29.53 71.75,29.53 72.39,30.16 DIG.P$9
N$15
  Top 0.406: U$6.GRID 73.14,9.32 72.39,8.57 58.1,8.57 57.47,9.21 57.47,27.62 58.42,28.57 73.98,28.57 74.93,29.53 DIG.P$8
N$16
  Bottom 0.61: U$8.F+ 34.84,11.35 U$7.F-
N$17
  Bottom 0.406: U$6.F+ 89.77,11.35 U$5.F-
N$18
  Bottom 0.406: R19.E R20.1
N$19
  Bottom 0.61: U$4.F+ 144.7,11.35 U$3.F-
N$20
  Bottom 0.406: R21.2 51.44,74.61 49.85,73.03 48.58,73.03 47.62,72.07 R19.A
N$21  (via drill 0.6)
  Top 0.61: DIG.P$7 77.47,27.94 76.83,27.3 60.33,27.3 58.74,25.72 58.74,10.48 59.37,9.84 v63.5,9.84
  Bottom 0.406: 40.96,11.32 U$7.F+ | 95.85,8.61 95.89,8.57
  Bottom 0.61: U$3.F+ 150.78,8.86 150.5,8.57 95.89,8.57 63.5,8.57 | 63.5,8.57 41.59,8.57 40.96,9.21 40.96,11.32 | U$5.F+ 95.85,8.61 | v63.5,9.84 63.5,8.57
N$22
  Bottom 0.61: IC2.3 38.42,58.42 39.69,57.15 Q1.G
N$23
  Bottom 0.406: R17.1 R16.2 36.2,64.56 36.2,65.41 35.88,65.72 IC2.7
N$24
  Bottom 0.305: C12.1 35.56,62.86 35.88,62.55
  Bottom 0.406: IC2.6 38.42,64.87 R16.1 38.42,64.03 38.42,62.86 38.1,62.55 35.88,62.55 IC2.2
N$26
  Bottom 0.406: R18.2 IC2.5 42.55,67.63 42.86,67.95 T9.C
N$27
  Bottom 0.61: C10.1 49.85,51.75 50.48,52.39 R3.1
N$28
  Top 0.305: R37.1 122.34,68.48 S.P$1
  Bottom 0.406: U$2.P$1 124.14,74.93 124.46,74.61 124.46,69.21 123.83,68.58 S.P$1
N$44
  Top 0.61: L2.2 49.53,55.56 48.89,54.93 D1.A
  Bottom 0.61: Q1.D 37.15,52.71 37.47,52.39 R3.2 D1.A
N$46
  Bottom 0.406: U$2.P$23 DS18B20.P$2 119.7,51.65 R38.1
N$52
  Bottom 0.406: IC6.19 83.82,52.71 84.45,52.07 85.72,52.07 86.36,51.43 86.36,44.45 VFD.P$3
N$53
  Bottom 0.406: IC6.18 85.09,53.98 86.36,52.71 88.27,52.71 88.9,52.07 88.9,44.45 VFD.P$2
N$54
  Top 0.406: LED1.2-DOUT 145.48,16.13 145.1,16.51 139.06,16.51 137.79,17.78 126.37,17.78 126.05,18.1 126.05,19.24 LED2.4-DIN
N$55  (via drill 0.6)
  Top 0.406: LED2.2-DOUT 120.08,16.13 119.7,16.51 115.25,16.51 114.94,16.19 v114.94,13.65 | LED3.4-DIN 96.2,19.3 96.2,18.1 96.52,17.78 102.23,17.78 102.55,17.46 v102.55,13.65
  Bottom 0.406: v102.55,13.65 v114.94,13.65
N$57
  Top 0.406: SZ.P$5 82.55,17.81 81.28,19.08 U$6.H
  Bottom 0.406: U$8.H U$7.H U$6.H U$5.H U$4.H U$3.H
N$58  (via drill 0.6)
  Top 0.406: SZ.P$9 72.39,4.13 71.75,4.76 53.34,4.76 52.07,6.03 v52.07,22.94
  Bottom 0.406: U$8.G U$7.G v52.07,22.94 53.34,22.94 U$6.G U$5.G U$4.G U$3.G
N$59  (via drill 0.6)
  Top 0.406: SZ.P$7 77.47,6.67 76.83,7.3 56.2,7.3 55.56,7.94 v55.56,20.44
  Bottom 0.406: U$8.B U$7.B 54.93,20.44 v55.56,20.44 U$6.B U$5.B U$4.B U$3.B
N$60
  Bottom 0.406: IC6.17 86.36,53.98 86.68,53.66 90.81,53.66 91.44,53.02 91.44,44.45 VFD.P$1
N$61
  Top 0.406: SZ.P$4 85.09,17.11 85.72,17.75 U$5.C
  Bottom 0.406: U$8.C U$7.C U$6.C U$5.C U$4.C U$3.C
N$62
  Top 0.406: SZ.P$3 87.63,14.4 U$5.D
  Bottom 0.406: U$8.D U$7.D U$6.D U$5.D U$4.D U$3.D
N$63
  Top 0.406: SZ.P$6 80.01,15.59 79.06,16.54 U$6.E
  Bottom 0.406: U$8.E U$7.E U$6.E U$5.E U$4.E U$3.E
N$64  (via drill 0.6)
  Top 0.406: SZ.P$8 74.93,5.4 74.3,6.03 54.61,6.03 53.66,6.99 v53.66,21.71
  Bottom 0.406: U$8.F U$7.F v53.66,21.71 54.93,21.71 U$6.F U$5.F U$4.F U$3.F
N$65
  Top 0.406: LED4.4-DIN 71.82,19.43 72.71,20.32 85.09,20.32 86.36,19.05 89.85,19.05 90.49,18.41 90.49,17.27 LED3.2-DOUT
N$66  (via drill 0.6)
  Top 0.406: LED5.4-DIN 41.4,17.97 41.59,17.78 47.31,17.78 47.62,17.46 v47.62,11.75 | v60.33,11.75 60.33,15.87 60.96,16.51 65.85,16.51 LED4.2-DOUT
  Bottom 0.406: v47.62,11.75 v60.33,11.75
N$70
  Top 0.61: D2.A 39.58,50.17 X2.1
N$71  (via drill 0.6)
  Top 0.406: LED1.4-DIN 151.26,22.35 152.72,23.81 v152.72,27.3
  Bottom 0.406: v152.72,27.3 85.72,27.3 85.09,27.94 DIG.P$4
N$72
  Top 0.305: U$2.P$2 124.36,72.39 R36.1
  Bottom 0.406: S.P$2 119.7,69.21 U$2.P$2
N$73
  Bottom 0.406: S1.P$2 105.73,76.84 106.36,77.47 115.57,77.47 115.89,77.15 115.89,73.66 U$2.P$8
N$74
  Top 0.406: X1.2 119.86,58.25 119.7,58.42 119.7,60.64 119.38,60.96 R39.1
N$75
  Top 0.406: R40.2 104.46,62.55 103.82,63.18 U$1.5
N$76
  Top 0.406: R39.2 114.94,60.96 114.3,61.6 103.19,61.6 102.55,62.23 U$1.6
N$77
  Top 0.406: X1.3 120.97,59.06 120.65,59.37 120.65,62.23 120.33,62.55 R40.1
N$78
  Top 0.406: LED5.2-DOUT 35.62,16.13 35.24,16.51 29.21,16.51 27.94,17.78 16.19,17.78 15.88,18.1 15.88,19.3 LED6.4-DIN
N$79
  Top 0.254: T15.2 105.41,56.2 106.05,56.83 106.05,57.3 T15.4
  Top 0.305: T15.4 106.06,57.8 106.36,58.1 U$1.14
N$80
  Top 0.305: Q2.3 96.04,65.66 C20.2 96.31,65.72 97.16,65.72 97.95,64.92 U$1.8
N$81  (via drill 0.6)
  Top 0.406: LED3.1-VDD 91.69,19.37 92.71,19.37 93.13,19.79 C16.2 91.76,21.27 91.44,21.59 89.22,21.59 88.9,21.91 v88.9,26.04 | LED2.1-VDD 121.22,19.37 122.24,19.37 122.66,19.79 C17.2 120.33,21.27 120.02,21.59 118.75,21.59 118.43,21.91 v118.43,26.04 | LED4.1-VDD 66.29,19.37 67.31,19.37 67.73,19.79 C15.2 65.72,21.27 65.41,21.59 63.82,21.59 63.5,21.91 v63.5,26.04 | LED5.1-VDD 36.77,19.37 37.78,19.37 38.2,19.79 C14.2 36.2,21.27 35.88,21.59 33.97,21.59 33.66,21.91 v33.66,26.04 | C13.2 12.8,19.79 12.38,19.37 11.05,19.37 | 11.05,19.37 LED6.1-VDD | 11.05,19.37 9.84,19.37 9.53,19.05 6.35,19.05 6.03,19.37 v6.03,26.04 | LED1.1-VDD 146.62,19.37 147.64,19.37 148.06,19.79 C18.2 146.69,21.27 146.37,21.59 144.15,21.59 143.51,22.22 v143.51,26.04
  Bottom 0.406: C22.2 82.55,29.85
  Bottom 0.61: v6.03,26.04 v33.66,26.04 v63.5,26.04 82.55,26.04 | 82.55,26.04 v88.9,26.04 v118.43,26.04 v143.51,26.04 | DIG.P$5 82.55,29.85 82.55,26.04
N$89
  Top 0.305: U$1.7 101.28,61.6 100.97,61.28 97.79,61.28 Q2.1 | 97.79,60.98 Q2.1 | C21.1 98.01,60.76 Q2.1
N$92
  Top 0.406: U$2.P$22 RX/TX.P$2
N$93
  Top 0.406: U$2.P$24 RX/TX.P$3
N$94
  Bottom 0.305: T16.C 100.48,56.68 SG1.-
N$95  (via drill 0.6)
  Top 0.305: U$2.P$5 117.16,76.2 116.52,76.84 95.57,76.84 94.93,76.2 v94.93,55.56
  Bottom 0.305: v94.93,55.56 94.93,51.75 95.57,51.12 97.96,51.12 T16.B
N$96
  Top 0.305: J1.2 128.59,70.17 127.95,70.8 123.83,70.8 123.19,70.49 117.79,70.49 117.16,71.12 U$2.P$6
  Bottom 0.305: R43.1 127.74,70.7 J1.2
N$105  (via drill 0.6)
  Top 0.406: SZ.P$10 51.75,2.86 50.8,3.81 v50.8,24.21
  Bottom 0.406: U$8.A U$7.A v50.8,24.21 52.7,24.21 U$6.A U$5.A U$4.A U$3.A
N$119
  Bottom 0.406: T9.B 40.32,73.98 40.96,74.61 R19.S
P1
  Top 0.406: NIXI.P$3 88.9,44.45 88.9,41.59 89.22,41.28 96.84,41.28 98.42,42.86 106.68,42.86 107,43.18 U$2.P$32
P10  (via drill 0.6)
  Top 0.406: v74.93,52.71 104.14,52.71 109.54,47.31 U$2.P$29
  Bottom 0.406: v74.93,52.71 NIXI.P$8
PRG  (via drill 0.6)
  Top 0.254: v102.87,57.47 104.61,57.47 T15.6
  Top 0.406: U$2.P$33 104.46,48.58 v102.87,50.17
  Bottom 0.406: v102.87,50.17 v102.87,57.47
RGB
  Top 0.406: NIXI.P$4 85.09,47.31 85.41,47.63 98.42,47.63 99.38,46.67 99.38,45.09 100.01,44.45 U$2.P$36
  Bottom 0.61: NIXI.P$4 VFD.P$4
SCL
  Top 0.406: I2C.P$2 110.49,42.86 113.03,42.86 113.35,43.18 113.35,45.72 U$2.P$25
  Bottom 0.406: R41.1 U$2.P$25
SDA
  Bottom 0.406: I2C.P$3 107.95,42.86 110.49,42.86 U$2.P$28 113.35,45.72 113.35,48.26 112.71,48.89 R42.1
VBB  (via drill 0.6)
  Top 0.61: v67.31,48.26 79.38,48.26 80.01,47.63 NIXI.P$6
  Bottom 0.61: 62.55,67.31 54.93,67.31 53.98,66.36 D1.C 53.98,53.98 54.61,53.34 C7.+ v67.31,48.26 | 62.55,67.31 IC6.1 | R20.2 62.55,67.31
Ó1  (via drill 0.6)
  Top 0.406: v72.39,53.66 105.09,53.66 110.81,47.94 110.81,45.72 U$2.P$30
  Bottom 0.406: v72.39,53.66 NIXI.P$9
Ó10  (via drill 0.6)
  Top 0.406: v69.85,54.61 105.73,54.61 112.08,48.26 U$2.P$27
  Bottom 0.406: v69.85,54.61 NIXI.P$10

### Text on the board
Top: UNFI
Bottom: UNFI
tPlace: ESP-32 UNICLOCK | 5V DC | UNFI | UNFI | ESP-32 UNICLOCK | A | G | F | B | E | H | C | D